# EAGLE design sht21 (EAGLE 7.3.0)
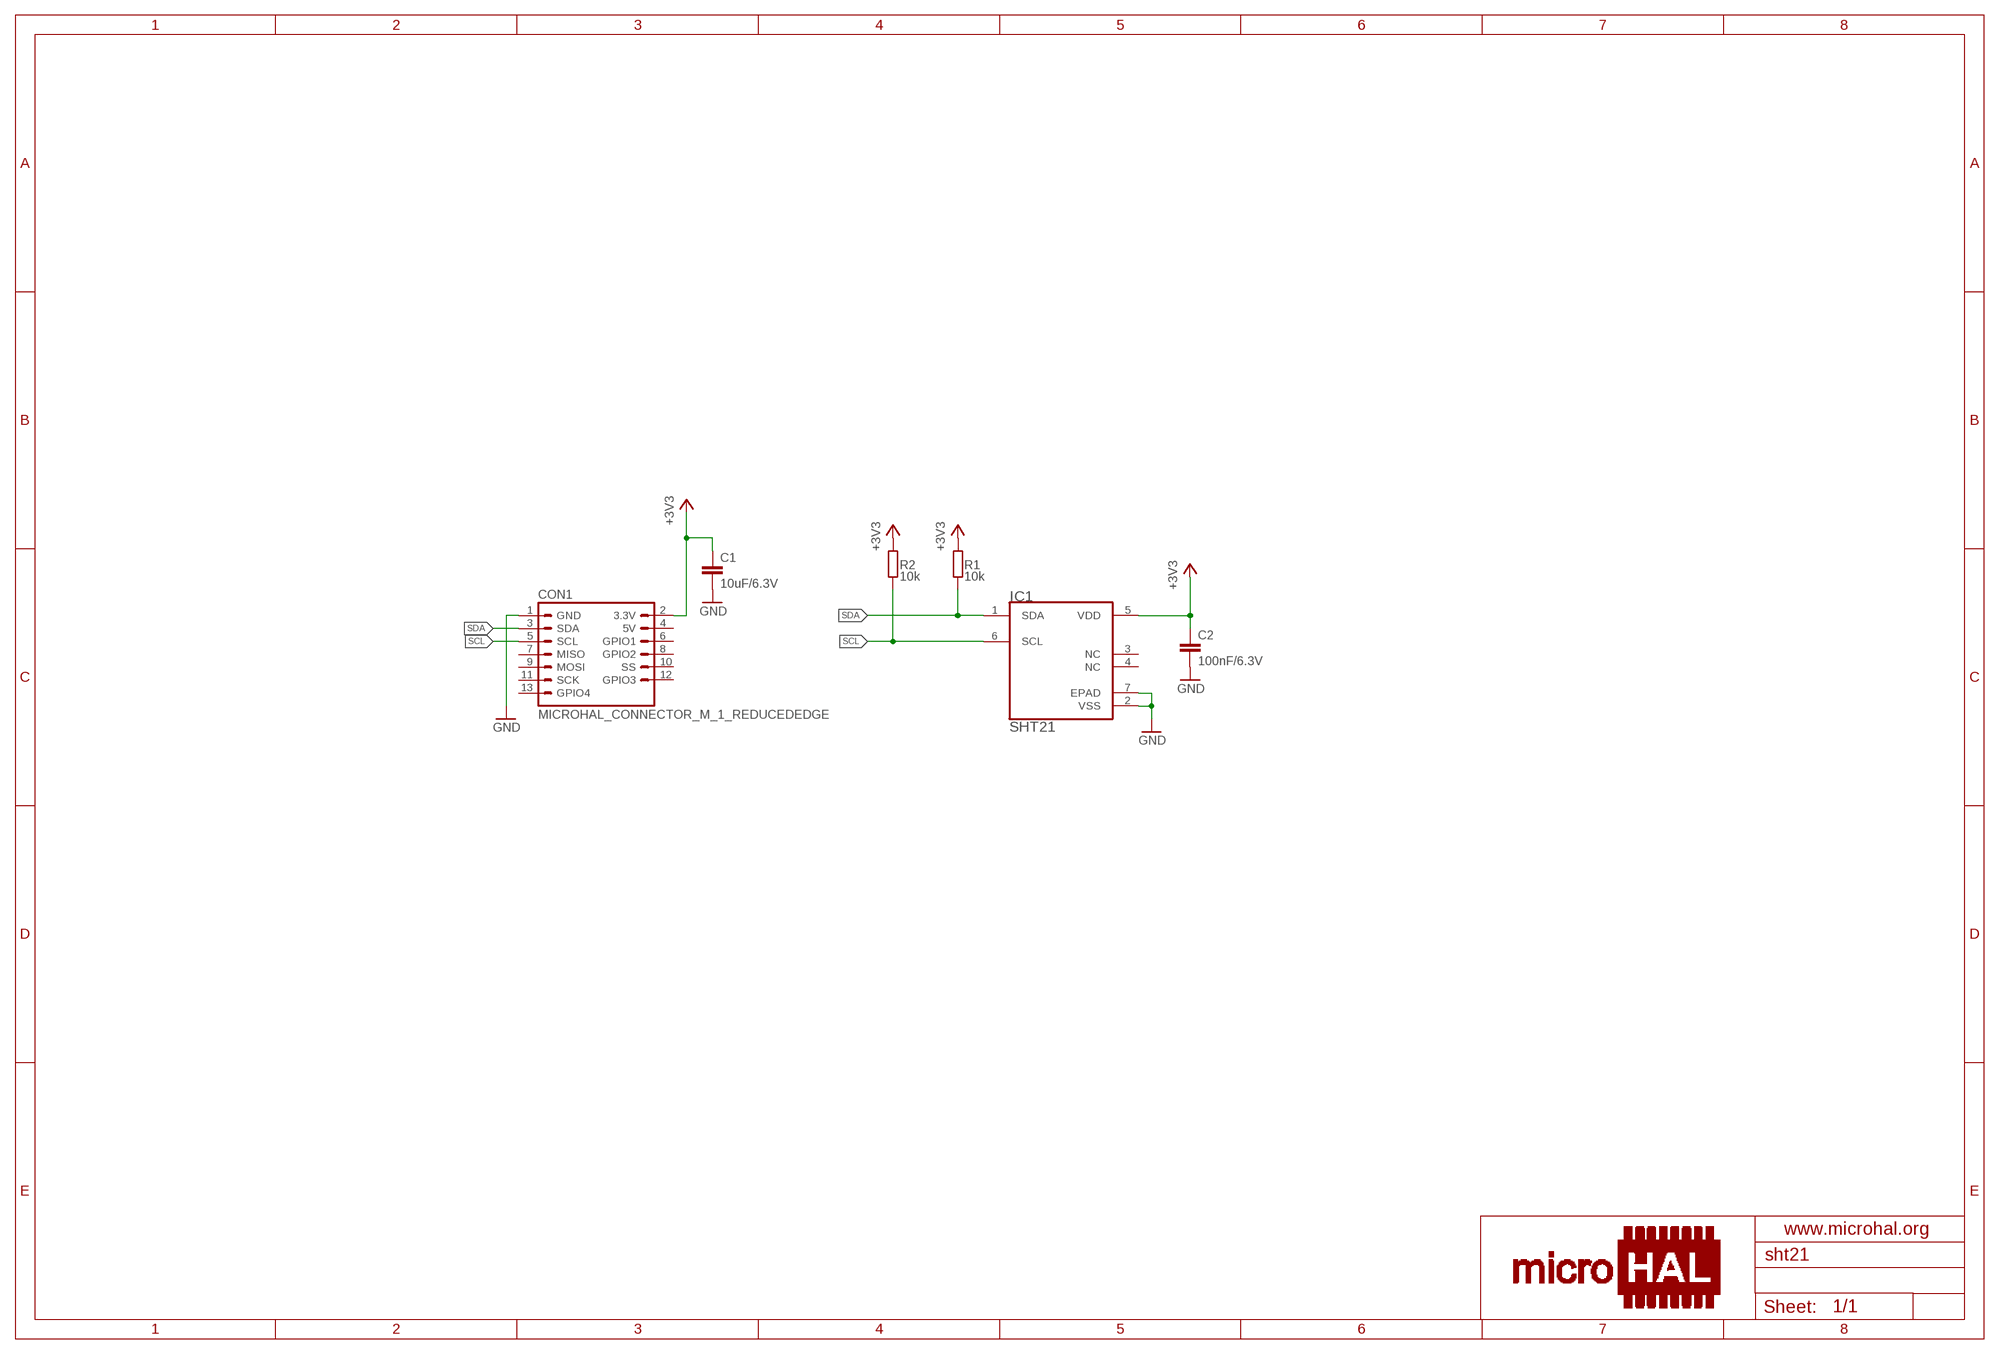
[diagram p0: schematic, sheet 1]

## Parts
C1  10uF/6.3V  C-EUC0603K  [C0603K]
C2  100nF/6.3V  C-EUC0603K  [C0603K]
CON1  MICROHAL_CONNECTOR_M_1_REDUCEDEDGE  [MICROHAL_CONNECTOR_M_1_REDUCED_EDGE]
IC1  SHT21  [DFN300X300X110-7N]
R1  10k  R-EU_R0603  [R0603]
R2  10k  R-EU_R0603  [R0603]

## Nets
+3V3: C1.1 C2.1 CON1.2(3.3V) IC1.5(VDD) R1.2 R2.2
GND: C1.2 C2.2 CON1.1(GND) IC1.2(VSS) IC1.7(EPAD)
SCL: CON1.5(SCL) IC1.6(SCL) R2.1
SDA: CON1.3(SDA) IC1.1(SDA) R1.1
Unconnected: CON1.4(5V) CON1.6(GPIO1) CON1.7(MISO) CON1.8(GPIO2) CON1.9(MOSI) CON1.10(SS) CON1.11(SCK) CON1.12(GPIO3) CON1.13(GPIO4) IC1.3(NC) IC1.4(NC)

## Library data of the parts
C1 C2 = rcl:C-EU: CAPACITOR, European symbol
CON1 = microhal-connector_v0.1:MICROHAL_CONNECTOR_M_1_REDUCED
IC1 = sht21:SHT21: SENSOR, HUMIDITY & TEMP; MPN: SHT21; OC_FARNELL: 1855468; OC_NEWARK: 20T1172; PACKAGE: DFN-6; SUPPLIER: SENSIRION
R1 R2 = rcl:R-EU_: RESISTOR, European symbol

## Board
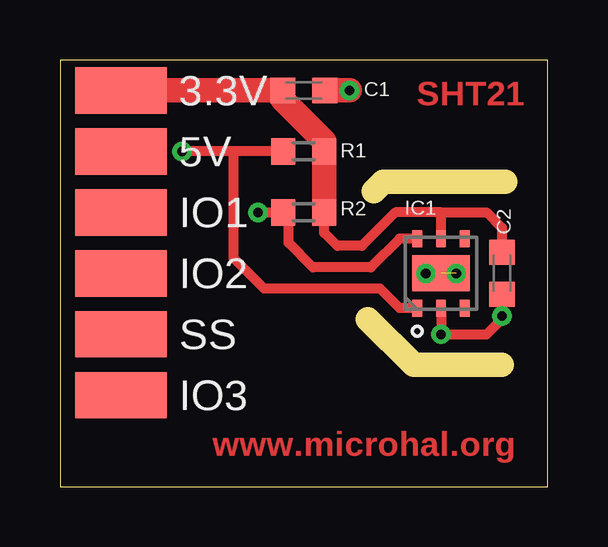
[diagram p1: board, top side]
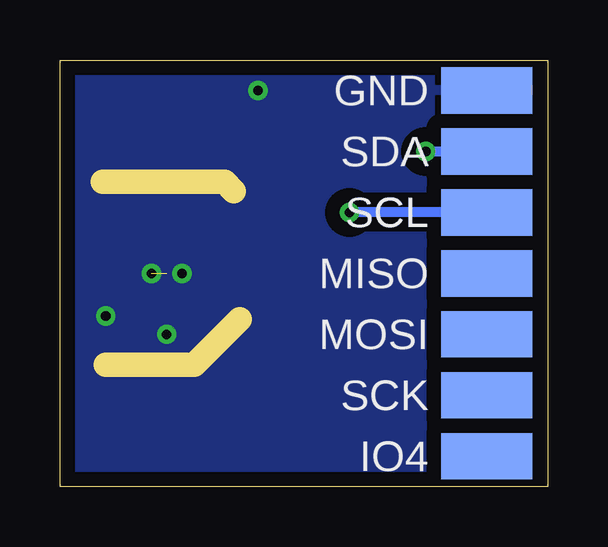
[diagram p2: board, bottom side, seen from below]

Size 20.32 x 17.78 mm. Coordinates in mm from the lower left corner, seen from the top.
Outline: 0,0 20.32,0 20.32,17.78 0,17.78 0,0
Copper layers (1*16): Top 0.035mm / dielectric 1.5mm / Bottom 0.035mm
Design rules "default *": minimum track width 10mil, minimum drill 24mil, track to track 8mil, track to pad 8mil, pad to pad 8mil, via to via 8mil, smd to smd 4mil, copper to edge 20mil, drill to drill 8mil, minimum pad ring 10mil, minimum via ring 8mil, stop-mask expansion 4mil, vias tented up to drill 16mil, thermal gap 10mil
Milling: 4 lines

### Footprints (pad centres in the part's own frame; a part is rotated, then mirrored left to right if it is on the bottom)
C0603K = smd 1.05 x 1.08: 1 -0.875,0; 2 0.875,0
MICROHAL_CONNECTOR_M_1_REDUCED_EDGE = smd 1.93 x 3.81 bottom: 1 -7.62,0; 3 -5.08,0; 5 -2.54,0; 7 0,0; 9 2.54,0; 11 5.08,0; 13 7.62,0 | smd 1.93 x 3.81: 2 -7.62,0; 4 -5.08,0; 6 -2.54,0; 8 0,0; 10 2.54,0; 12 5.08,0
DFN300X300X110-7N = smd 0.711 x 0.406: 1 -1.448,0.991; 2 -1.448,0; 3 -1.448,-0.991; 4 1.448,-0.991; 5 1.448,0; 6 1.448,0.991 | smd 1.499 x 2.388: 7 0,0
R0603 = smd 1 x 1.1: 1 -0.85,0; 2 0.85,0

### Placement (x,y rotation side)
C1  10.16,16.51 0 top
C2  18.41,8.89 270 top
CON1  2.54,8.89 270 top
IC1  15.88,8.89 90 top
R1  10.16,13.97 0 top
R2  10.16,11.43 0 top

### Tracks (layer width: path | path; a pad name or v marks a point on that pad's centre or on a via)
+3V3
  Top 0.406: IC1.5 15.88,11.43 | 15.88,11.43 17.78,11.43 18.41,10.79 C2.1 | 15.88,11.43 13.97,11.43 12.57,10.03 11.56,10.03 11.01,10.58 R2.2
  Top 1.016: CON1.2 C1.1 9.29,16.11 11.01,14.39 R1.2 R2.2
GND  (via drill 0.4)  (1 unrouted)
  Top 0.406: IC1.2 v15.88,6.35 17.78,6.35 18.41,6.99 C2.2
  Top 1.016: C1.2 v12.06,16.51
  other vias: 15.24,8.89 16.51,8.89 18.41,7.11
  pour Bottom (isolate 0.61): 0,17.78 20.32,17.78 20.32,0 0,0
SCL  (via drill 0.4)
  Top 0.406: IC1.6 14.15,10.34 12.95,9.14 10.54,9.14 9.53,10.16 9.53,11.21 R2.1 v8.26,11.43
  Bottom 0.406: CON1.5 v8.26,11.43
SDA  (via drill 0.4)
  Top 0.406: IC1.1 14.15,7.44 13.34,8.26 8.51,8.26 7.24,9.53 7.24,13.97 | R1.1 7.24,13.97 | 7.24,13.97 v5.08,13.97
  Bottom 0.406: v5.08,13.97 CON1.3

### Text on the board
Top: SHT21 | www.microhal.org
tStop: SHT21 | www.microhal.org